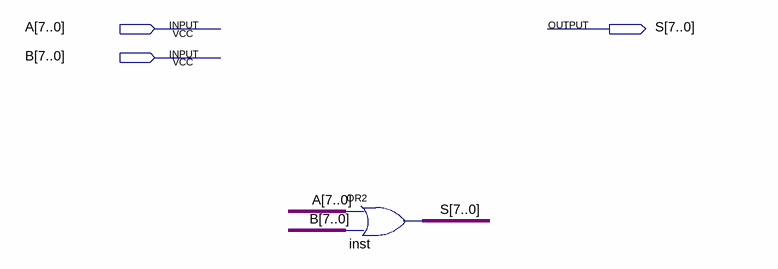
[diagram p0: schematic sheet]
// Quartus schematic OR8b.bdf as structural Verilog: 1 symbols, 3 pins
module OR8b (
  input  [7:0] A,
  input  [7:0] B,
  output [7:0] S
);

  assign S = A | B;  // OR2 inst, 8 bits wide
endmodule
